# EAGLE design sensor (EAGLE 9.6.1)
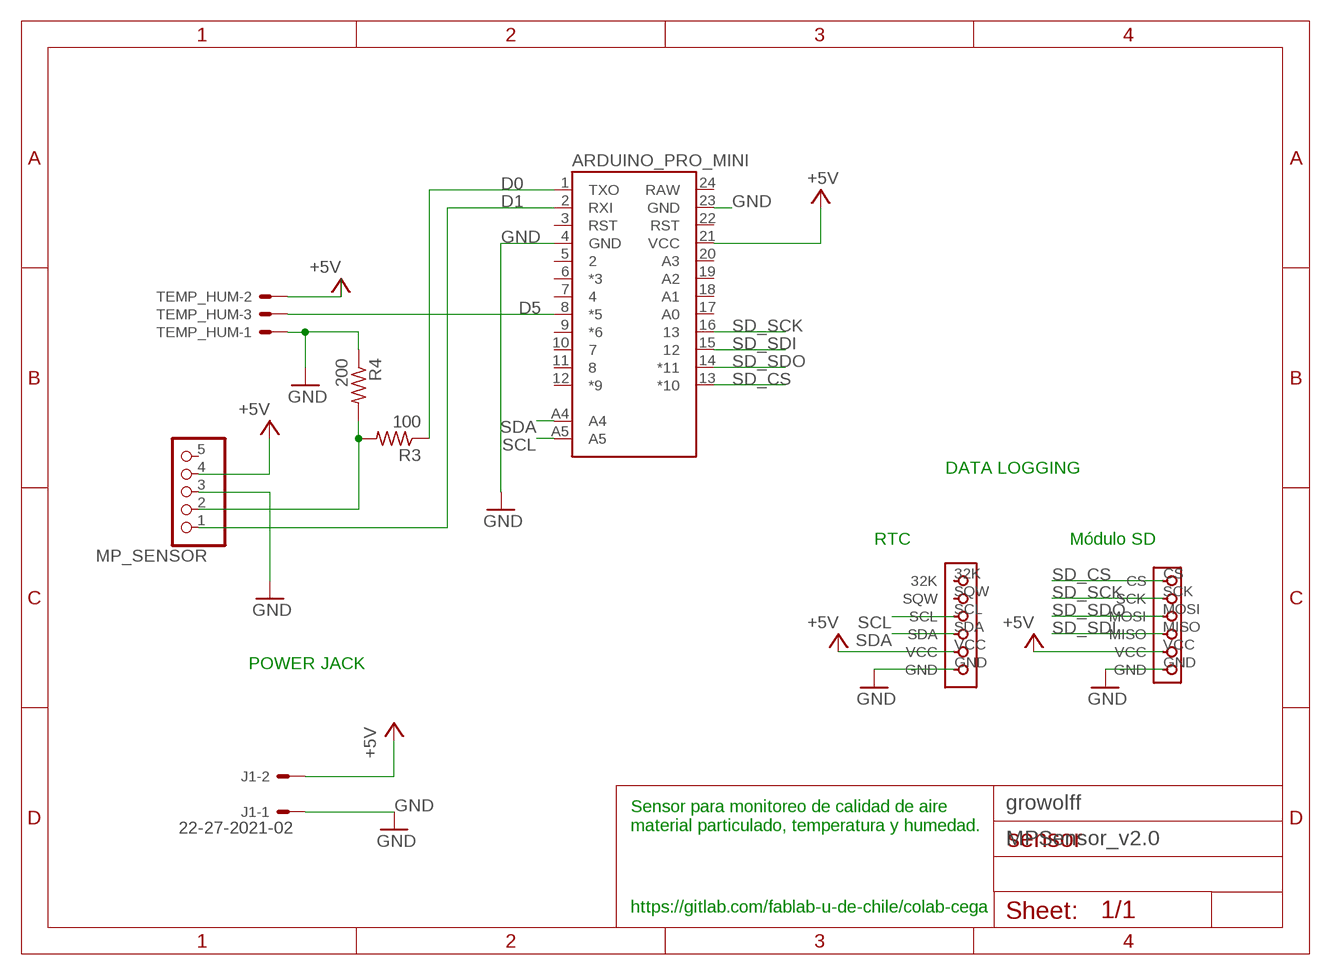
[diagram p0: schematic, sheet 1]

## Parts
ARDUINO_PRO_MINI  PRO_MINI_CEGAPRO_MINI_MOD  [ARDUINO_PRO_MINI_MOD]
J1  22-27-2021-02  [6410-02]
MP_SENSOR  PINHD-1X5  [1X05]
R3  100  R-US_0207/7  [0207/7]
R4  200  R-US_0207/7  [0207/7]
RTC  DS3231_RTC  [DS3231_RTC]
SD_READER  MICRO_SD_READER  [MICRO_SD_READER]
TEMP_HUM  22-27-2031-03  [6410-03]

## Nets
+5V: ARDUINO_PRO_MINI.21(VCC) J1.2 MP_SENSOR.4 RTC.VCC SD_READER.VCC TEMP_HUM.2
D0: ARDUINO_PRO_MINI.1(TXO) R3.1
D1: ARDUINO_PRO_MINI.2(RXI) MP_SENSOR.1
D5: ARDUINO_PRO_MINI.8(*5) TEMP_HUM.3
GND: ARDUINO_PRO_MINI.4(GND) ARDUINO_PRO_MINI.23(GND) J1.1 MP_SENSOR.3 R4.1 RTC.GND SD_READER.GND TEMP_HUM.1
N$2: MP_SENSOR.2 R3.2 R4.2
SCL: ARDUINO_PRO_MINI.A5 RTC.SCL
SD_CS: ARDUINO_PRO_MINI.13(*10) SD_READER.CS
SD_SCK: ARDUINO_PRO_MINI.16 SD_READER.SCK
SD_SDI: ARDUINO_PRO_MINI.15 SD_READER.MISO
SD_SDO: ARDUINO_PRO_MINI.14(*11) SD_READER.MOSI
SDA: ARDUINO_PRO_MINI.A4 RTC.SDA
Unconnected: ARDUINO_PRO_MINI.3(RST) ARDUINO_PRO_MINI.5 ARDUINO_PRO_MINI.6(*3) ARDUINO_PRO_MINI.7 ARDUINO_PRO_MINI.9(*6) ARDUINO_PRO_MINI.10 ARDUINO_PRO_MINI.11 ARDUINO_PRO_MINI.12(*9) ARDUINO_PRO_MINI.17(A0) ARDUINO_PRO_MINI.18(A1) ARDUINO_PRO_MINI.19(A2) ARDUINO_PRO_MINI.20(A3) ARDUINO_PRO_MINI.22(RST) MP_SENSOR.5 RTC.32K RTC.SQW

## Notes on the sheet
- DATA LOGGING
- RTC | Módulo SD
- POWER JACK
- growolff
- Sensor para monitoreo de calidad de aire
  material particulado, temperatura y humedad.
- MPSensor_v2.0
- https://gitlab.com/fablab-u-de-chile/colab-cega

## Power pins joined to a net without a drawn wire
RAW: ARDUINO_PRO_MINI.24(RAW)

## Library data of the parts
ARDUINO_PRO_MINI = fablab_uchile:PRO_MINI_CEGA
J1 = con-molex:22-?-02: CONNECTOR wire to board 2.54 mm (.1 inch) pitch header; MF: MOLEX; OC_FARNELL: unknown; OC_NEWARK: unknown
MP_SENSOR = pinhead:PINHD-1X5: PIN HEADER
R3 R4 = resistor:R-US_: RESISTOR, American symbol
RTC = fablab_uchile:DS3231_RTC
SD_READER = fablab_uchile:MICRO_SD_READER
TEMP_HUM = con-molex:22-?-03: CONNECTOR wire to board 2.54 mm (.1 inch) pitch header; MF: MOLEX; OC_FARNELL: unknown; OC_NEWARK: unknown

## Board
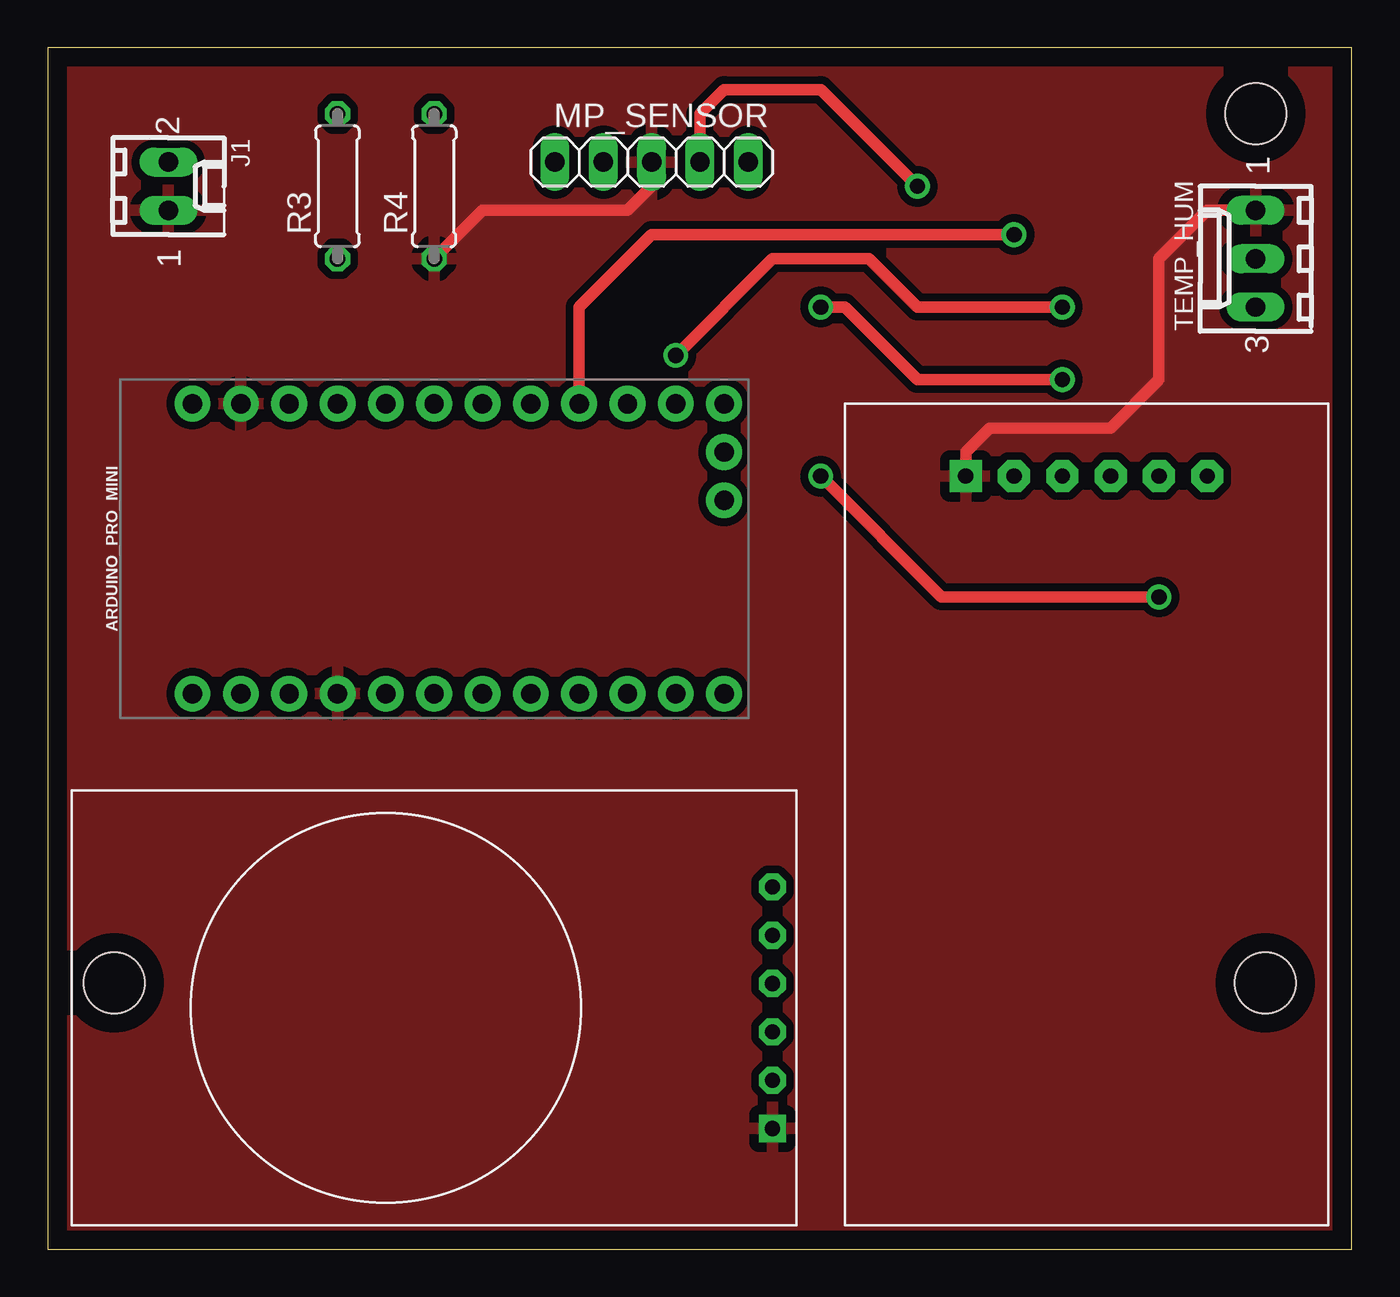
[diagram p1: board, top side]
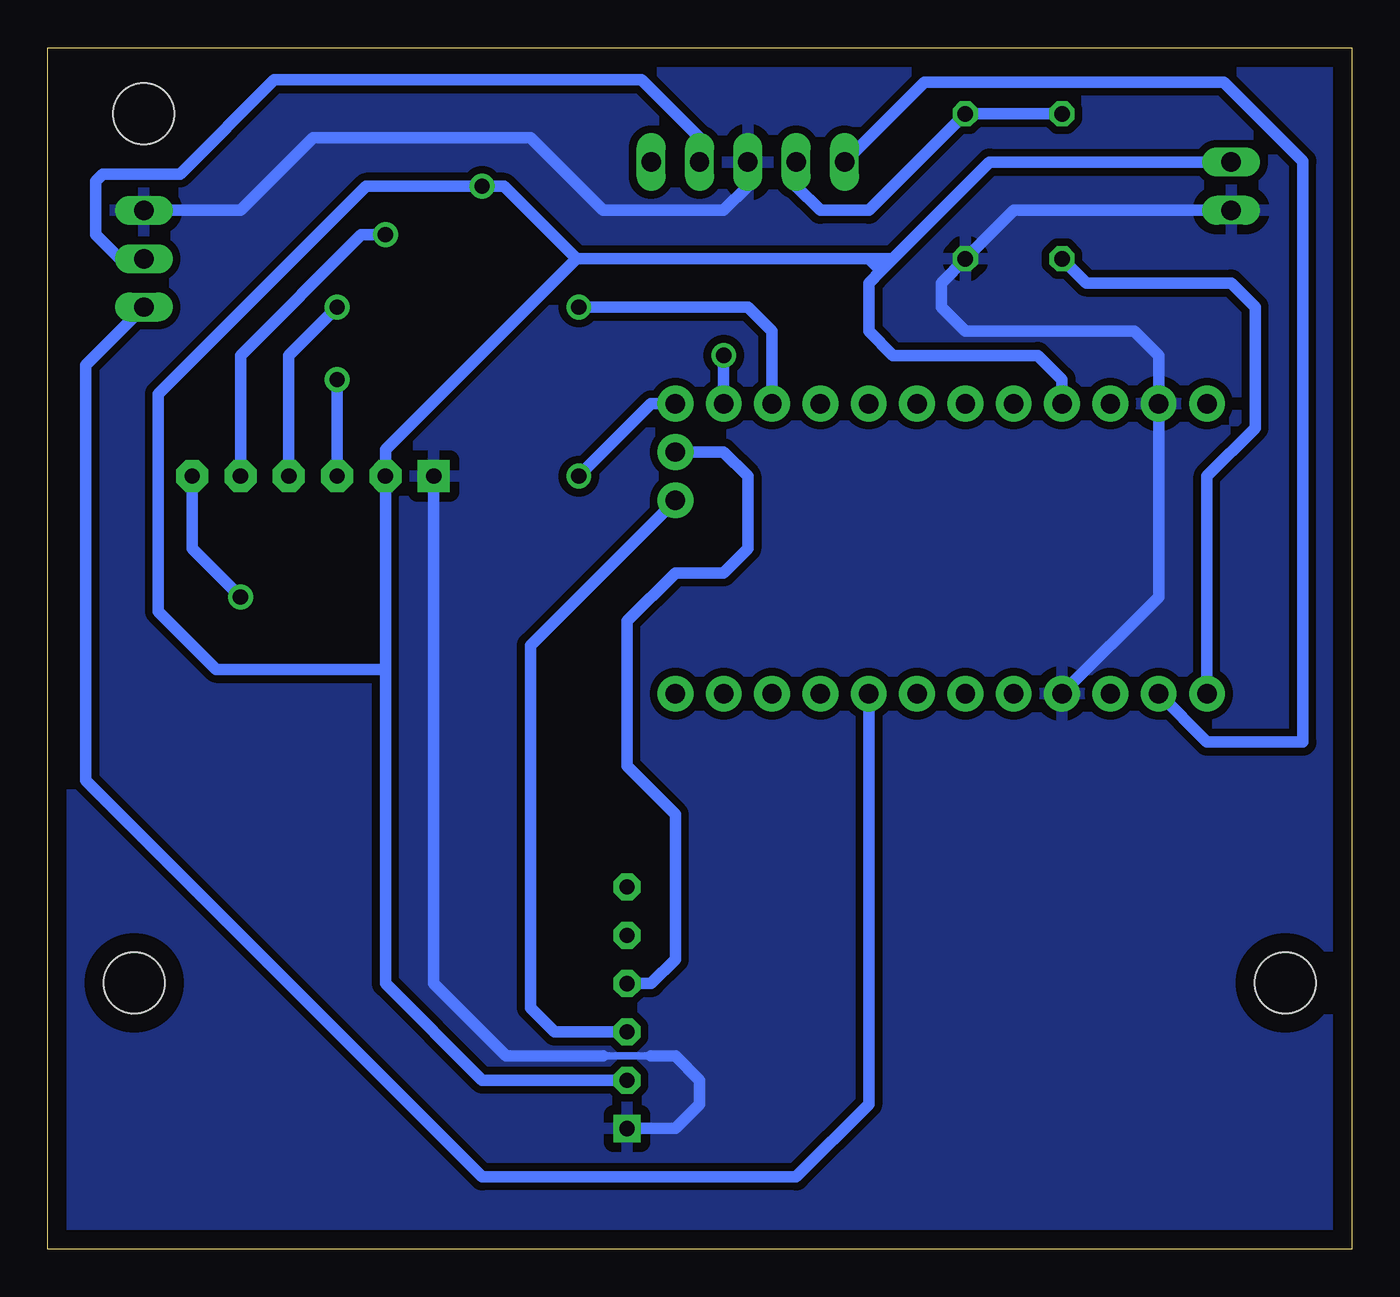
[diagram p2: board, bottom side, seen from below]

Size 68.56 x 63.17 mm. Coordinates in mm from the lower left corner, seen from the top.
Outline: 0,0 68.56,0 68.56,63.17 0,63.17 0,0
Copper layers (1*16): Top 0.035mm / dielectric 1.5mm / Bottom 0.035mm
Design rules "Fablab U. de Chile": minimum track width 0.3mm, minimum drill 0.6mm, track to track 0.3mm, track to pad 0.3mm, pad to pad 0.3mm, via to via 0.3mm, smd to smd 0.3mm, copper to edge 1mm, drill to drill 0.3mm, minimum pad ring 10mil, minimum via ring 10mil, stop-mask expansion 10mil, vias tented up to drill 0mil, thermal gap 20mil
Holes 3.2 mm at 3.5,14 64,14 63.5,59.69

### Footprints (pad centres in the part's own frame; a part is rotated, then mirrored left to right if it is on the bottom)
ARDUINO_PRO_MINI_MOD = drill 1.016 pad 1.88: 1 -7.62,12.7; 2 -7.62,10.16; 3 -7.62,7.62; 4 -7.62,5.08; 5 -7.62,2.54; 6 -7.62,0; 7 -7.62,-2.54; 8 -7.62,-5.08; 9 -7.62,-7.62; 10 -7.62,-10.16; 11 -7.62,-12.7; 12 -7.62,-15.24; 13 7.62,-15.24; 14 7.62,-12.7; 15 7.62,-10.16; 16 7.62,-7.62; 17 7.62,-5.08; 18 7.62,-2.54; 19 7.62,0; 20 7.62,2.54; 21 7.62,5.08; 22 7.62,7.62; 23 7.62,10.16; 24 7.62,12.7; A4 2.54,-15.24; A5 5.08,-15.24
6410-02 = drill 1.016 long: 1 1.27,0; 2 -1.27,0
1X05 = drill 1.016 long: 1 -5.08,0; 2 -2.54,0; 3 0,0; 4 2.54,0; 5 5.08,0
0207/7 = drill 0.813 octagon: 1 -3.81,0; 2 3.81,0
DS3231_RTC = drill 0.8 pad 1.422 octagon: 32K -6.35,10.16; SCL -1.27,10.16; SDA 1.27,10.16; SQW -3.81,10.16; VCC 3.81,10.16 | drill 0.8 pad 1.422 square: GND 6.35,10.16
MICRO_SD_READER = drill 0.8 pad 1.676 octagon: CS 6.35,11.43; MISO -1.27,11.43; MOSI 1.27,11.43; SCK 3.81,11.43; VCC -3.81,11.43 | drill 0.8 pad 1.676 square: GND -6.35,11.43
6410-03 = drill 1.016 long: 1 2.54,0; 2 0,0; 3 -2.54,0

### Placement (x,y rotation side)
ARDUINO_PRO_MINI  20.32,36.83 90 top
J1  6.35,55.88 270 top
MP_SENSOR  31.75,57.15 0 top
R3  15.24,55.88 90 top
R4  20.32,55.88 90 top
RTC  27.94,12.7 270 top
SD_READER  54.61,29.21 0 top
TEMP_HUM  63.5,52.07 90 top

### Tracks (layer width: path | path; a pad name or v marks a point on that pad's centre or on a via)
+5V  (via drill 0.8 pad 1.3)
  Top 0.61: MP_SENSOR.4 34.29,59.69 35.56,60.96 40.64,60.96 v45.72,55.88
  Bottom 0.61: RTC.VCC 45.72,8.89 50.8,13.97 50.8,30.48 | 50.8,30.48 SD_READER.VCC 50.8,42.04 40.77,52.07 | 24.13,52.07 24.77,51.44 | 24.77,51.44 25.4,50.8 25.4,48.26 24.13,46.99 16.51,46.99 15.24,45.72 ARDUINO_PRO_MINI.21 | 40.77,52.07 25.4,52.07 | 25.4,52.07 24.13,52.07 | J1.2 19.05,57.15 24.13,52.07 | MP_SENSOR.4 34.29,58.42 37.34,61.47 56.64,61.47 61.59,56.52 65.66,56.52 66.04,56.13 66.04,53.34 64.77,52.07 TEMP_HUM.2 | 40.77,52.07 44.58,55.88 v45.72,55.88 51.82,55.88 62.74,44.96 62.74,33.53 59.69,30.48 50.8,30.48 | 24.77,51.44 25.4,52.07
D0
  Bottom 0.61: ARDUINO_PRO_MINI.1 7.62,40.64 5.08,43.18 5.08,49.53 6.35,50.8 13.97,50.8 R3.1
D1
  Bottom 0.61: ARDUINO_PRO_MINI.2 7.62,26.67 2.58,26.67 2.58,57.19 6.73,61.34 22.48,61.34 MP_SENSOR.1
D5
  Bottom 0.61: ARDUINO_PRO_MINI.8 25.4,7.62 29.21,3.81 45.72,3.81 66.55,24.64 66.55,46.48 TEMP_HUM.3
GND
  Top 0.61: MP_SENSOR.3 31.75,55.88 30.48,54.61 22.86,54.61 R4.1 | TEMP_HUM.1 60.96,54.61 58.42,52.07 58.42,45.72 55.88,43.18 49.53,43.18 48.26,41.91 SD_READER.GND
  Bottom 0.406: 39.37,10.16 36.83,10.16
  Bottom 0.61: RTC.GND 35.56,6.35 34.29,7.62 34.29,8.89 35.56,10.16 36.83,10.16 | SD_READER.GND 48.26,13.97 44.45,10.16 39.37,10.16 | J1.1 17.78,54.61 R4.1 21.59,50.8 21.59,49.53 20.32,48.26 11.43,48.26 10.16,46.99 ARDUINO_PRO_MINI.23 10.16,34.29 ARDUINO_PRO_MINI.4 | MP_SENSOR.3 31.75,55.88 33.02,54.61 39.37,54.61 43.18,58.42 54.61,58.42 58.42,54.61 TEMP_HUM.1
  pour Top (isolate 0.406): 0,64.77 0,0 68.58,0 68.58,64.77
  pour Bottom (isolate 0.406): 0,63.5 0,0 68.58,0 68.58,63.5
N$2
  Bottom 0.61: R3.2 R4.2 25.4,54.61 27.94,54.61 29.21,55.88 MP_SENSOR.2
SCL
  Bottom 0.61: ARDUINO_PRO_MINI.A5 33.02,41.91 31.75,40.64 31.75,36.83 33.02,35.56 35.56,35.56 38.1,33.02 38.1,25.4 35.56,22.86 35.56,15.24 36.83,13.97 RTC.SCL
SD_CS  (via drill 0.8 pad 1.3)
  Top 0.61: v58.42,34.29 46.99,34.29 v40.64,40.64
  Bottom 0.61: SD_READER.CS 60.96,36.83 v58.42,34.29 | v40.64,40.64 36.83,44.45 ARDUINO_PRO_MINI.13
SD_SCK  (via drill 0.8 pad 1.3)
  Top 0.61: v50.8,53.34 31.75,53.34 27.94,49.53 ARDUINO_PRO_MINI.16
  Bottom 0.61: SD_READER.SCK 58.42,46.99 52.07,53.34 v50.8,53.34
SD_SDI  (via drill 0.8 pad 1.3)
  Top 0.61: v53.34,45.72 45.72,45.72 41.91,49.53 v40.64,49.53
  Bottom 0.61: ARDUINO_PRO_MINI.15 30.48,48.26 31.75,49.53 v40.64,49.53 | v53.34,45.72 SD_READER.MISO
SD_SDO  (via drill 0.8 pad 1.3)
  Top 0.61: v53.34,49.53 45.72,49.53 43.18,52.07 38.1,52.07 v33.02,46.99
  Bottom 0.61: v53.34,49.53 55.88,46.99 SD_READER.MOSI | v33.02,46.99 ARDUINO_PRO_MINI.14
SDA
  Bottom 0.61: RTC.SDA 41.91,11.43 43.18,12.7 43.18,31.75 ARDUINO_PRO_MINI.A4